# EAGLE design Motor_board_Rev0 (EAGLE 7.1.0)
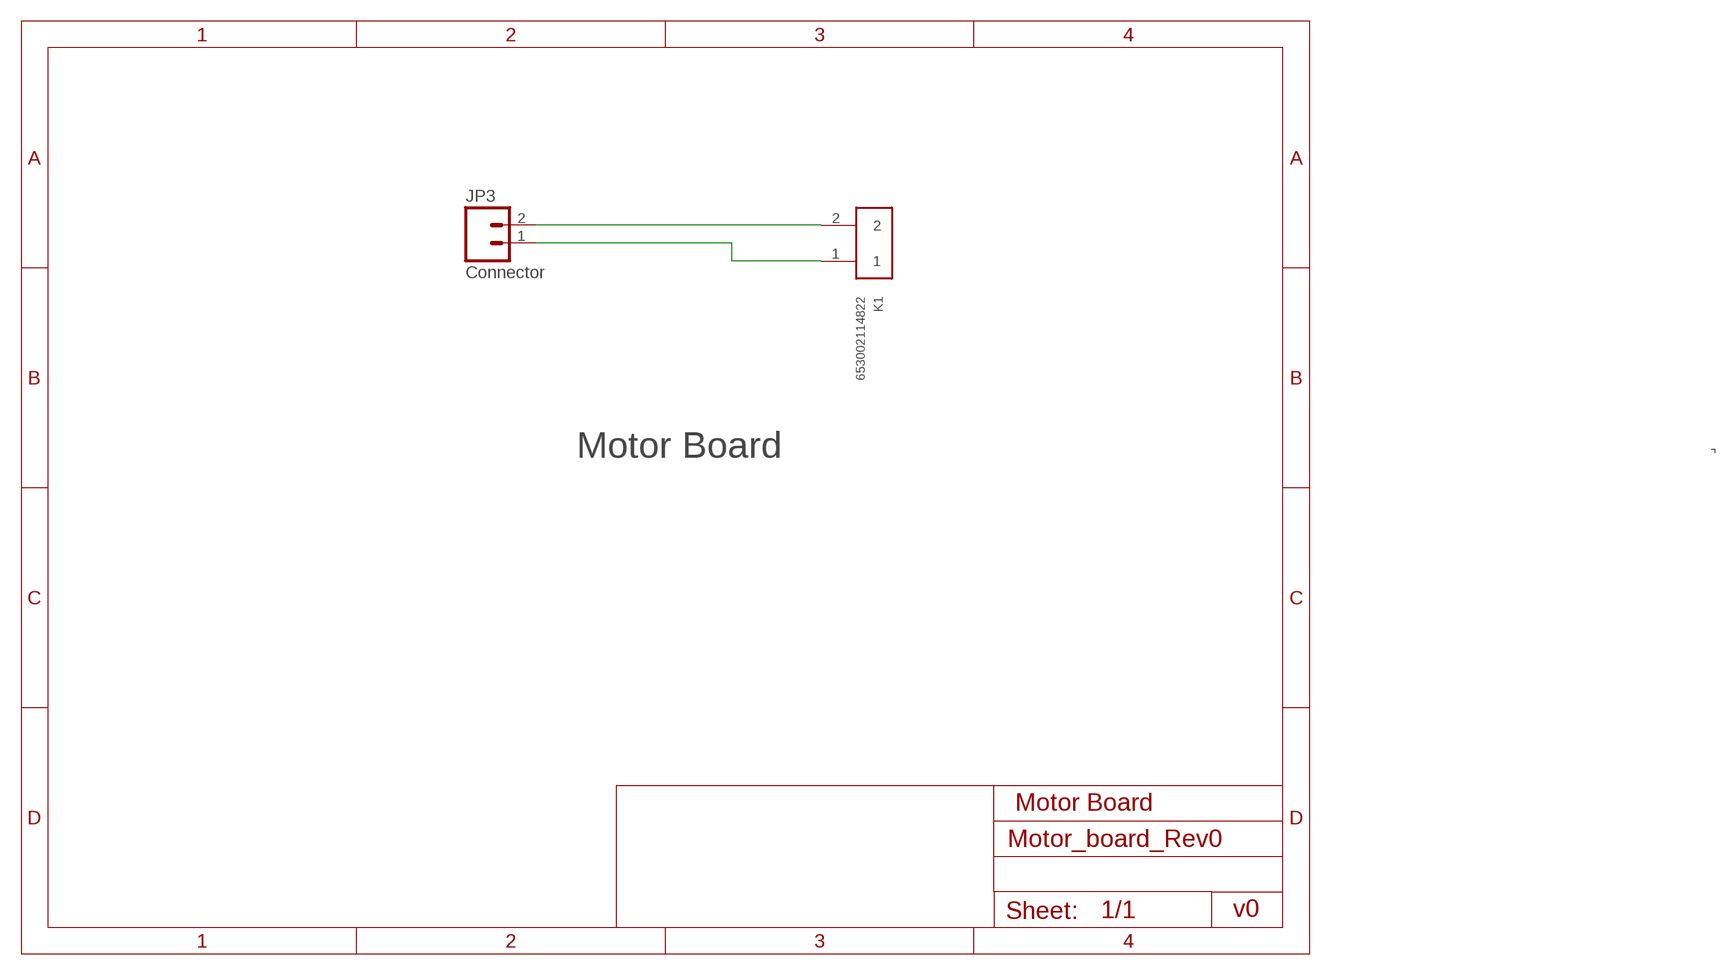
[diagram p0: schematic, sheet 1]

## Parts
JP3  Connector  M02PTH  [1X02]
K1  653002114822  [653002114822]

## Nets
N$1: JP3.1 K1.1
VBAT: JP3.2 K1.2

## Notes on the sheet
- Motor Board
- Motor Board
- v0

## Library data of the parts
JP3 = SparkFun:M02: Header 2 Standard 2-pin 0.1" header. Use with straight break away headers (SKU : PRT-00116), right angle break away headers (PRT-00553), swiss pins (PRT-00743), machine pins (PRT-00117), and female headers (PRT-00115). Molex polarized connector foot print use with SKU : PRT-08233 with associated crimp pins and housings.
K1 = Wuerth_Elektronik_eiCan_Wire_to_Board_Connectors:653002114822: WR-WTB 1.25mm Male Vertical Shrouded Header, 2 Pins=>Code : Con_WTB_1.25_PCB_THT_653002114822 <http://katalog.we-online.de/media/thumbs2/eican/thb_Con_WTB_1.25_PCB_THT_6530xx114822_pf2.jpg> Details see: http://katalog.we-online.de/en/em/653_0xx_114_822 Created 2014-06-06, Karrer Zheng 2014 (C) Würth Elektronik; OC_FARNELL: unknown

## Net classes
1 RFSIG: width 0.457 mm, clearance 0.205 mm to class 0, clearance 0.205 mm

## Board
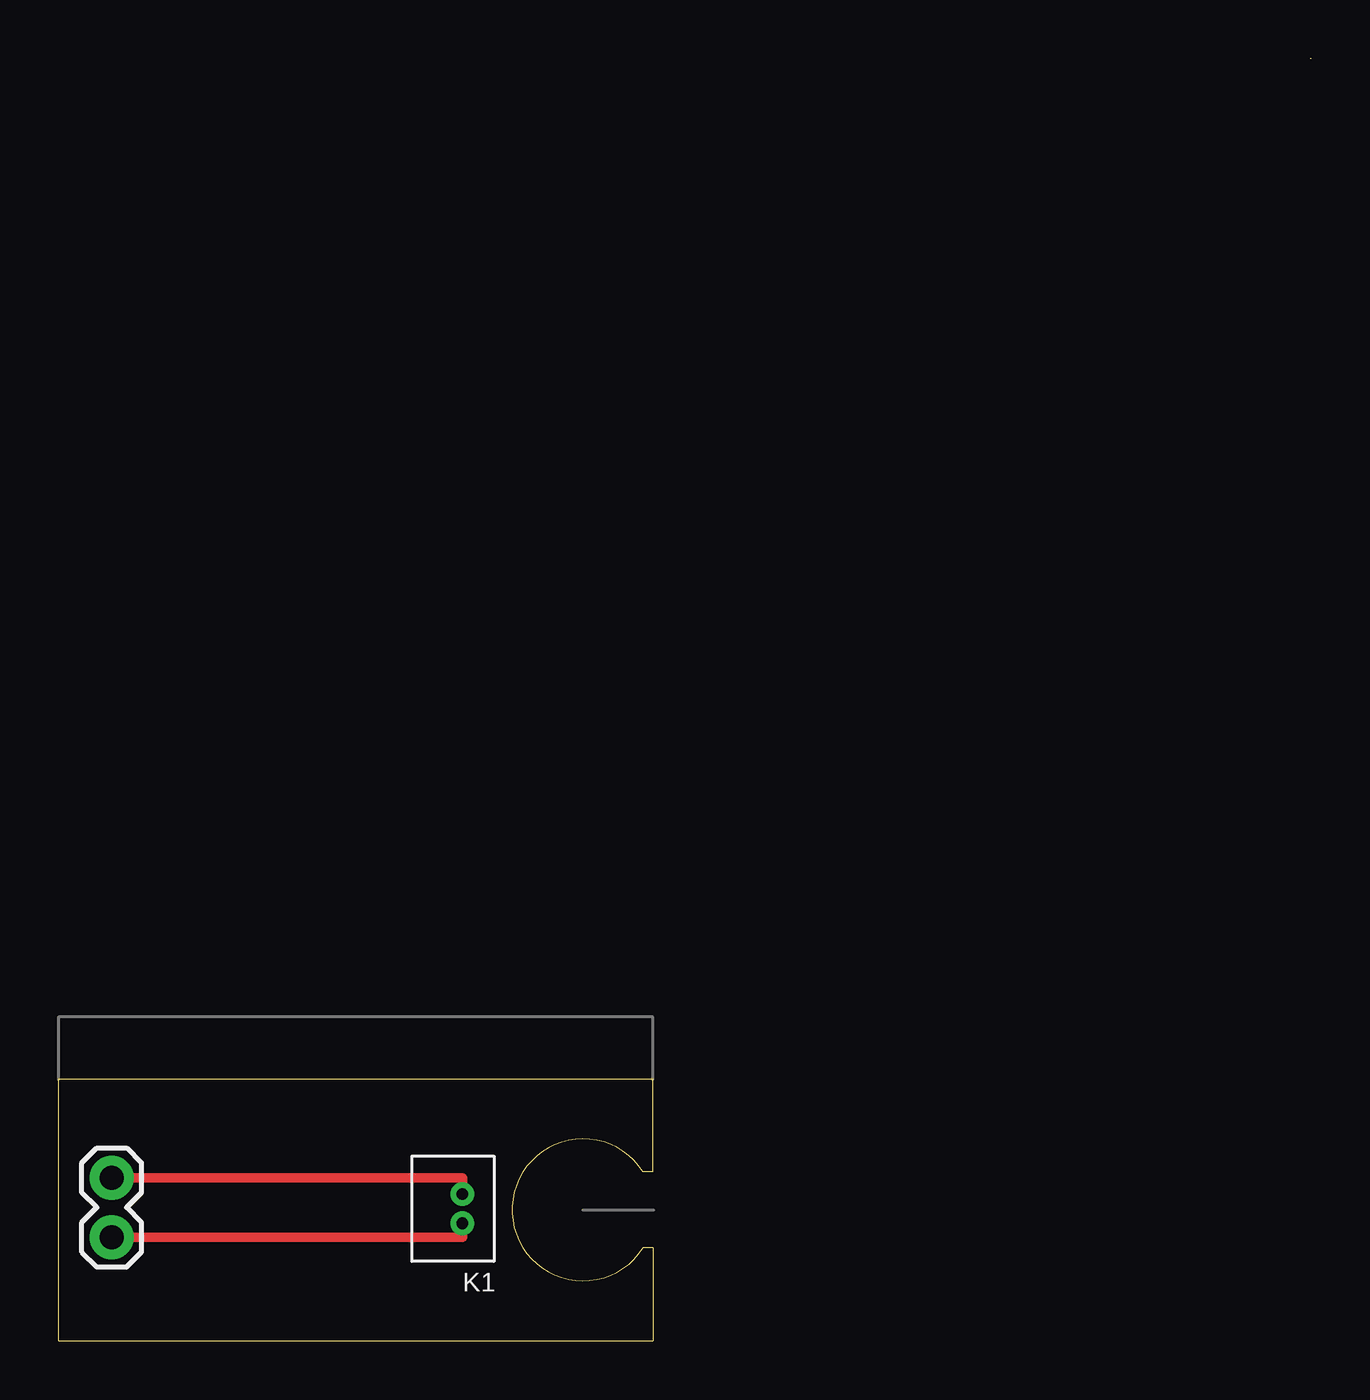
[diagram p1: board, top side]

Size 53.42 x 54.69 mm. Coordinates in mm from the lower left corner, seen from the top.
Outline: 53.42,54.69 53.39,54.69
Outline: 0,0 0,11.15 25.35,11.15 25.35,7.21 24.92,7.21 arc295 24.92,3.96 25.35,3.96 25.35,0 0,0
Copper layers (1*16): Top 0.035559375mm / dielectric 1.501140625mm / Bottom 0.035559375mm
Design rules "4pcb-33board *": minimum track width 8mil, minimum drill 15mil, track to track 6mil, track to pad 6mil, pad to pad 6mil, via to via 6mil, smd to smd 6mil, copper to edge 10mil, drill to drill 10mil, minimum pad ring 10mil, minimum via ring 8mil, stop-mask expansion 4mil, vias tented up to drill 0mil, thermal gap 10mil

### Footprints (pad centres in the part's own frame; a part is rotated, then mirrored left to right if it is on the bottom)
1X02 = drill 1.016 pad 1.88: 1 0,0; 2 2.54,0
653002114822 = drill 0.5: 1 0.625,0; 2 -0.625,0

### Placement (x,y rotation side)
JP3  2.26,4.42 90 top
K1  17.22,5.64 270 top

### Tracks (layer width: path | path; a pad name or v marks a point on that pad's centre or on a via)
N$1
  Top 0.406: K1.1 17.22,4.42 JP3.1
VBAT
  Top 0.406: JP3.2 17.22,6.96 K1.2